# EAGLE schematic 008 (EAGLE 9.6.2)

## Sheet 1 of 3
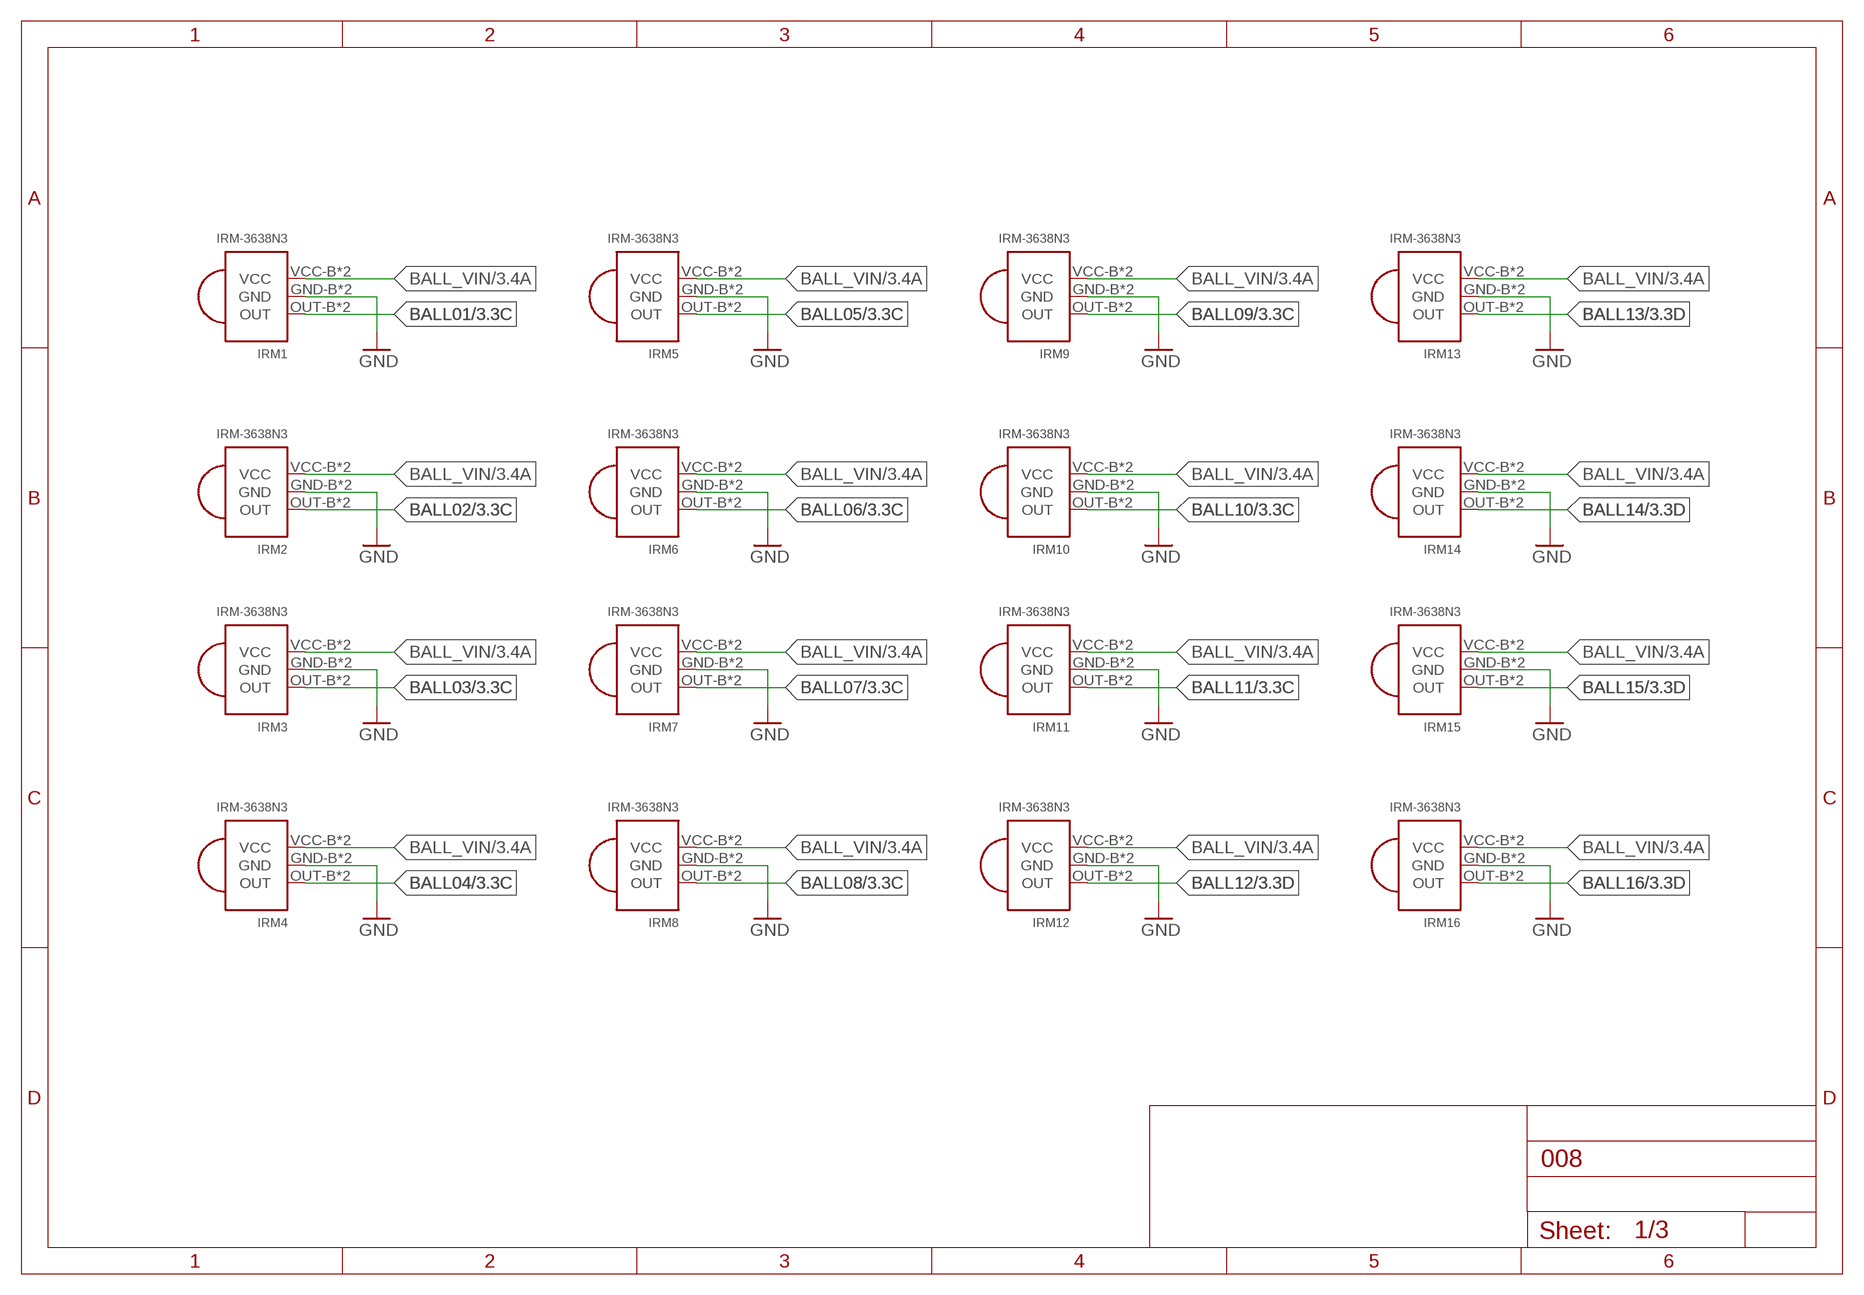
[diagram p0: schematic, sheet 1]

### Parts
IRM1  IRM-3638N3  MYPARTS_IRM_3633N3IRM  [MYPARTS_IRM_3633N3]
IRM2  IRM-3638N3  MYPARTS_IRM_3633N3IRM  [MYPARTS_IRM_3633N3]
IRM3  IRM-3638N3  MYPARTS_IRM_3633N3IRM  [MYPARTS_IRM_3633N3]
IRM4  IRM-3638N3  MYPARTS_IRM_3633N3IRM  [MYPARTS_IRM_3633N3]
IRM5  IRM-3638N3  MYPARTS_IRM_3633N3IRM  [MYPARTS_IRM_3633N3]
IRM6  IRM-3638N3  MYPARTS_IRM_3633N3IRM  [MYPARTS_IRM_3633N3]
IRM7  IRM-3638N3  MYPARTS_IRM_3633N3IRM  [MYPARTS_IRM_3633N3]
IRM8  IRM-3638N3  MYPARTS_IRM_3633N3IRM  [MYPARTS_IRM_3633N3]
IRM9  IRM-3638N3  MYPARTS_IRM_3633N3IRM  [MYPARTS_IRM_3633N3]
IRM10  IRM-3638N3  MYPARTS_IRM_3633N3IRM  [MYPARTS_IRM_3633N3]
IRM11  IRM-3638N3  MYPARTS_IRM_3633N3IRM  [MYPARTS_IRM_3633N3]
IRM12  IRM-3638N3  MYPARTS_IRM_3633N3IRM  [MYPARTS_IRM_3633N3]
IRM13  IRM-3638N3  MYPARTS_IRM_3633N3IRM  [MYPARTS_IRM_3633N3]
IRM14  IRM-3638N3  MYPARTS_IRM_3633N3IRM  [MYPARTS_IRM_3633N3]
IRM15  IRM-3638N3  MYPARTS_IRM_3633N3IRM  [MYPARTS_IRM_3633N3]
IRM16  IRM-3638N3  MYPARTS_IRM_3633N3IRM  [MYPARTS_IRM_3633N3]

### Nets
BALL01: IRM1.OUT-B(OUT) IRM1.OUT-T(OUT) ; also sheet 3
BALL02: IRM2.OUT-B(OUT) IRM2.OUT-T(OUT) ; also sheet 3
BALL03: IRM3.OUT-B(OUT) IRM3.OUT-T(OUT) ; also sheet 3
BALL04: IRM4.OUT-B(OUT) IRM4.OUT-T(OUT) ; also sheet 3
BALL05: IRM5.OUT-B(OUT) IRM5.OUT-T(OUT) ; also sheet 3
BALL06: IRM6.OUT-B(OUT) IRM6.OUT-T(OUT) ; also sheet 3
BALL07: IRM7.OUT-B(OUT) IRM7.OUT-T(OUT) ; also sheet 3
BALL08: IRM8.OUT-B(OUT) IRM8.OUT-T(OUT) ; also sheet 3
BALL09: IRM9.OUT-B(OUT) IRM9.OUT-T(OUT) ; also sheet 3
BALL10: IRM10.OUT-B(OUT) IRM10.OUT-T(OUT) ; also sheet 3
BALL11: IRM11.OUT-B(OUT) IRM11.OUT-T(OUT) ; also sheet 3
BALL12: IRM12.OUT-B(OUT) IRM12.OUT-T(OUT) ; also sheet 3
BALL13: IRM13.OUT-B(OUT) IRM13.OUT-T(OUT) ; also sheet 3
BALL14: IRM14.OUT-B(OUT) IRM14.OUT-T(OUT) ; also sheet 3
BALL15: IRM15.OUT-B(OUT) IRM15.OUT-T(OUT) ; also sheet 3
BALL16: IRM16.OUT-B(OUT) IRM16.OUT-T(OUT) ; also sheet 3
BALL_VIN: IRM1.VCC-B(VCC) IRM1.VCC-T(VCC) IRM2.VCC-B(VCC) IRM2.VCC-T(VCC) IRM3.VCC-B(VCC) IRM3.VCC-T(VCC) IRM4.VCC-B(VCC) IRM4.VCC-T(VCC) IRM5.VCC-B(VCC) IRM5.VCC-T(VCC) IRM6.VCC-B(VCC) IRM6.VCC-T(VCC) IRM7.VCC-B(VCC) IRM7.VCC-T(VCC) IRM8.VCC-B(VCC) IRM8.VCC-T(VCC) IRM9.VCC-B(VCC) IRM9.VCC-T(VCC) IRM10.VCC-B(VCC) IRM10.VCC-T(VCC) IRM11.VCC-B(VCC) IRM11.VCC-T(VCC) IRM12.VCC-B(VCC) IRM12.VCC-T(VCC) IRM13.VCC-B(VCC) IRM13.VCC-T(VCC) IRM14.VCC-B(VCC) IRM14.VCC-T(VCC) IRM15.VCC-B(VCC) IRM15.VCC-T(VCC) IRM16.VCC-B(VCC) IRM16.VCC-T(VCC) ; also sheet 3
GND [PWR]: IRM1.GND-B(GND) IRM1.GND-T(GND) IRM2.GND-B(GND) IRM2.GND-T(GND) IRM3.GND-B(GND) IRM3.GND-T(GND) IRM4.GND-B(GND) IRM4.GND-T(GND) IRM5.GND-B(GND) IRM5.GND-T(GND) IRM6.GND-B(GND) IRM6.GND-T(GND) IRM7.GND-B(GND) IRM7.GND-T(GND) IRM8.GND-B(GND) IRM8.GND-T(GND) IRM9.GND-B(GND) IRM9.GND-T(GND) IRM10.GND-B(GND) IRM10.GND-T(GND) IRM11.GND-B(GND) IRM11.GND-T(GND) IRM12.GND-B(GND) IRM12.GND-T(GND) IRM13.GND-B(GND) IRM13.GND-T(GND) IRM14.GND-B(GND) IRM14.GND-T(GND) IRM15.GND-B(GND) IRM15.GND-T(GND) IRM16.GND-B(GND) IRM16.GND-T(GND) ; also sheet 2,3

## Sheet 2 of 3
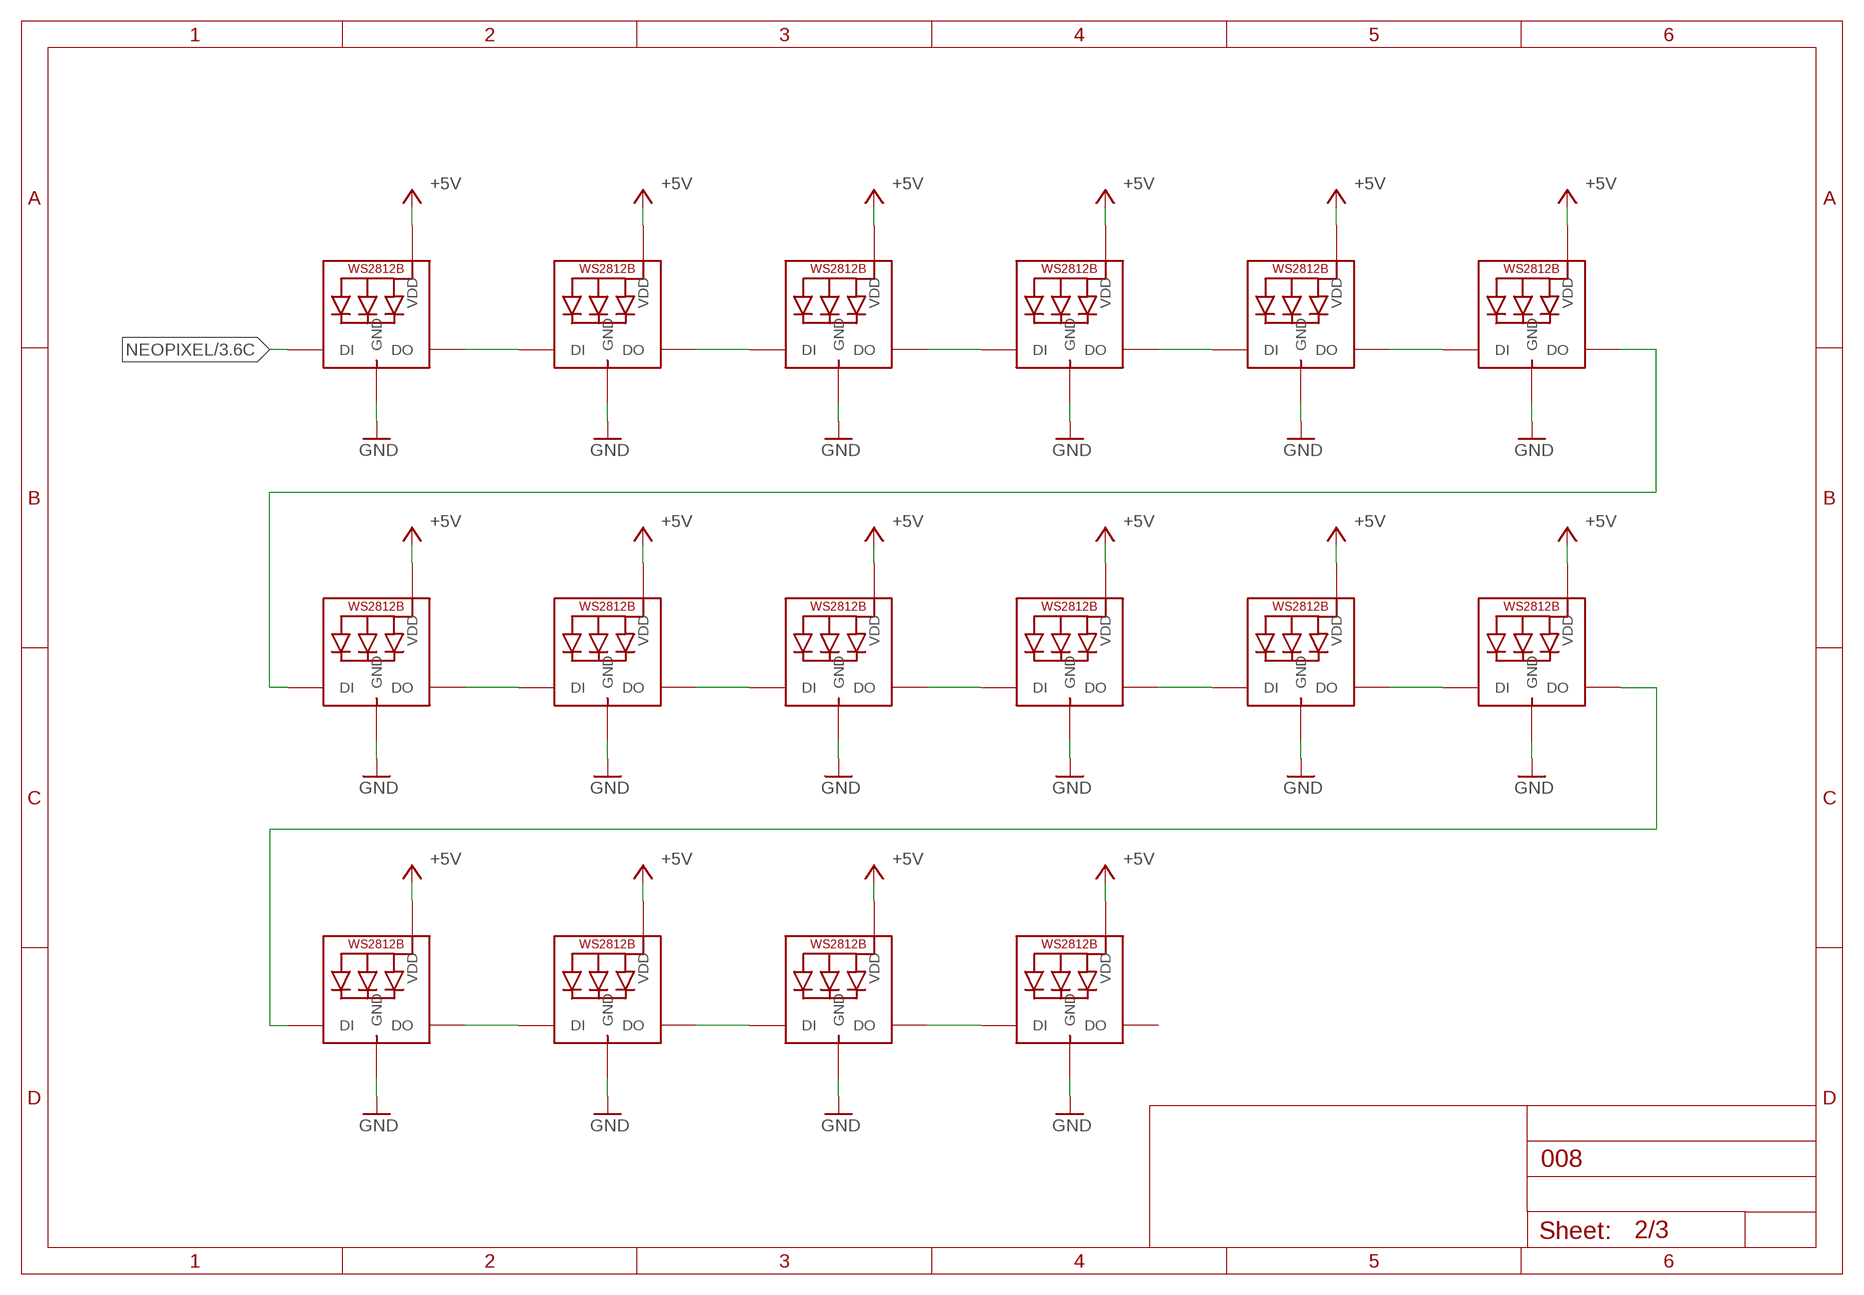
[diagram p1: schematic, sheet 2]

### Parts
LED1  WS2812B5050  [WS2812B]
LED2  WS2812B5050  [WS2812B]
LED3  WS2812B5050  [WS2812B]
LED4  WS2812B5050  [WS2812B]
LED5  WS2812B5050  [WS2812B]
LED6  WS2812B5050  [WS2812B]
LED7  WS2812B5050  [WS2812B]
LED8  WS2812B5050  [WS2812B]
LED9  WS2812B5050  [WS2812B]
LED10  WS2812B5050  [WS2812B]
LED11  WS2812B5050  [WS2812B]
LED12  WS2812B5050  [WS2812B]
LED13  WS2812B5050  [WS2812B]
LED14  WS2812B5050  [WS2812B]
LED15  WS2812B5050  [WS2812B]
LED16  WS2812B5050  [WS2812B]

### Nets
+5V [PWR]: LED1.1-VDD(VDD) LED2.1-VDD(VDD) LED3.1-VDD(VDD) LED4.1-VDD(VDD) LED5.1-VDD(VDD) LED6.1-VDD(VDD) LED7.1-VDD(VDD) LED8.1-VDD(VDD) LED9.1-VDD(VDD) LED10.1-VDD(VDD) LED11.1-VDD(VDD) LED12.1-VDD(VDD) LED13.1-VDD(VDD) LED14.1-VDD(VDD) LED15.1-VDD(VDD) LED16.1-VDD(VDD) ; also sheet 3
GND [PWR]: LED1.3-GND(GND) LED2.3-GND(GND) LED3.3-GND(GND) LED4.3-GND(GND) LED5.3-GND(GND) LED6.3-GND(GND) LED7.3-GND(GND) LED8.3-GND(GND) LED9.3-GND(GND) LED10.3-GND(GND) LED11.3-GND(GND) LED12.3-GND(GND) LED13.3-GND(GND) LED14.3-GND(GND) LED15.3-GND(GND) LED16.3-GND(GND) ; also sheet 1,3
N$1: LED12.2-DOUT(DO) LED13.4-DIN(DI)
N$2: LED6.2-DOUT(DO) LED7.4-DIN(DI)
NEOPIXEL: LED1.4-DIN(DI) ; also sheet 3
NEOPIXEL1: LED1.2-DOUT(DO) LED2.4-DIN(DI)
NEOPIXEL2: LED2.2-DOUT(DO) LED3.4-DIN(DI)
NEOPIXEL3: LED3.2-DOUT(DO) LED4.4-DIN(DI)
NEOPIXEL4: LED4.2-DOUT(DO) LED5.4-DIN(DI)
NEOPIXEL5: LED5.2-DOUT(DO) LED6.4-DIN(DI)
NEOPIXEL6: LED7.2-DOUT(DO) LED8.4-DIN(DI)
NEOPIXEL7: LED8.2-DOUT(DO) LED9.4-DIN(DI)
NEOPIXEL8: LED9.2-DOUT(DO) LED10.4-DIN(DI)
NEOPIXEL9: LED10.2-DOUT(DO) LED11.4-DIN(DI)
NEOPIXEL10: LED11.2-DOUT(DO) LED12.4-DIN(DI)
NEOPIXEL11: LED13.2-DOUT(DO) LED14.4-DIN(DI)
NEOPIXEL12: LED14.2-DOUT(DO) LED15.4-DIN(DI)
NEOPIXEL13: LED15.2-DOUT(DO) LED16.4-DIN(DI)
Unconnected: LED16.2-DOUT(DO)

## Sheet 3 of 3
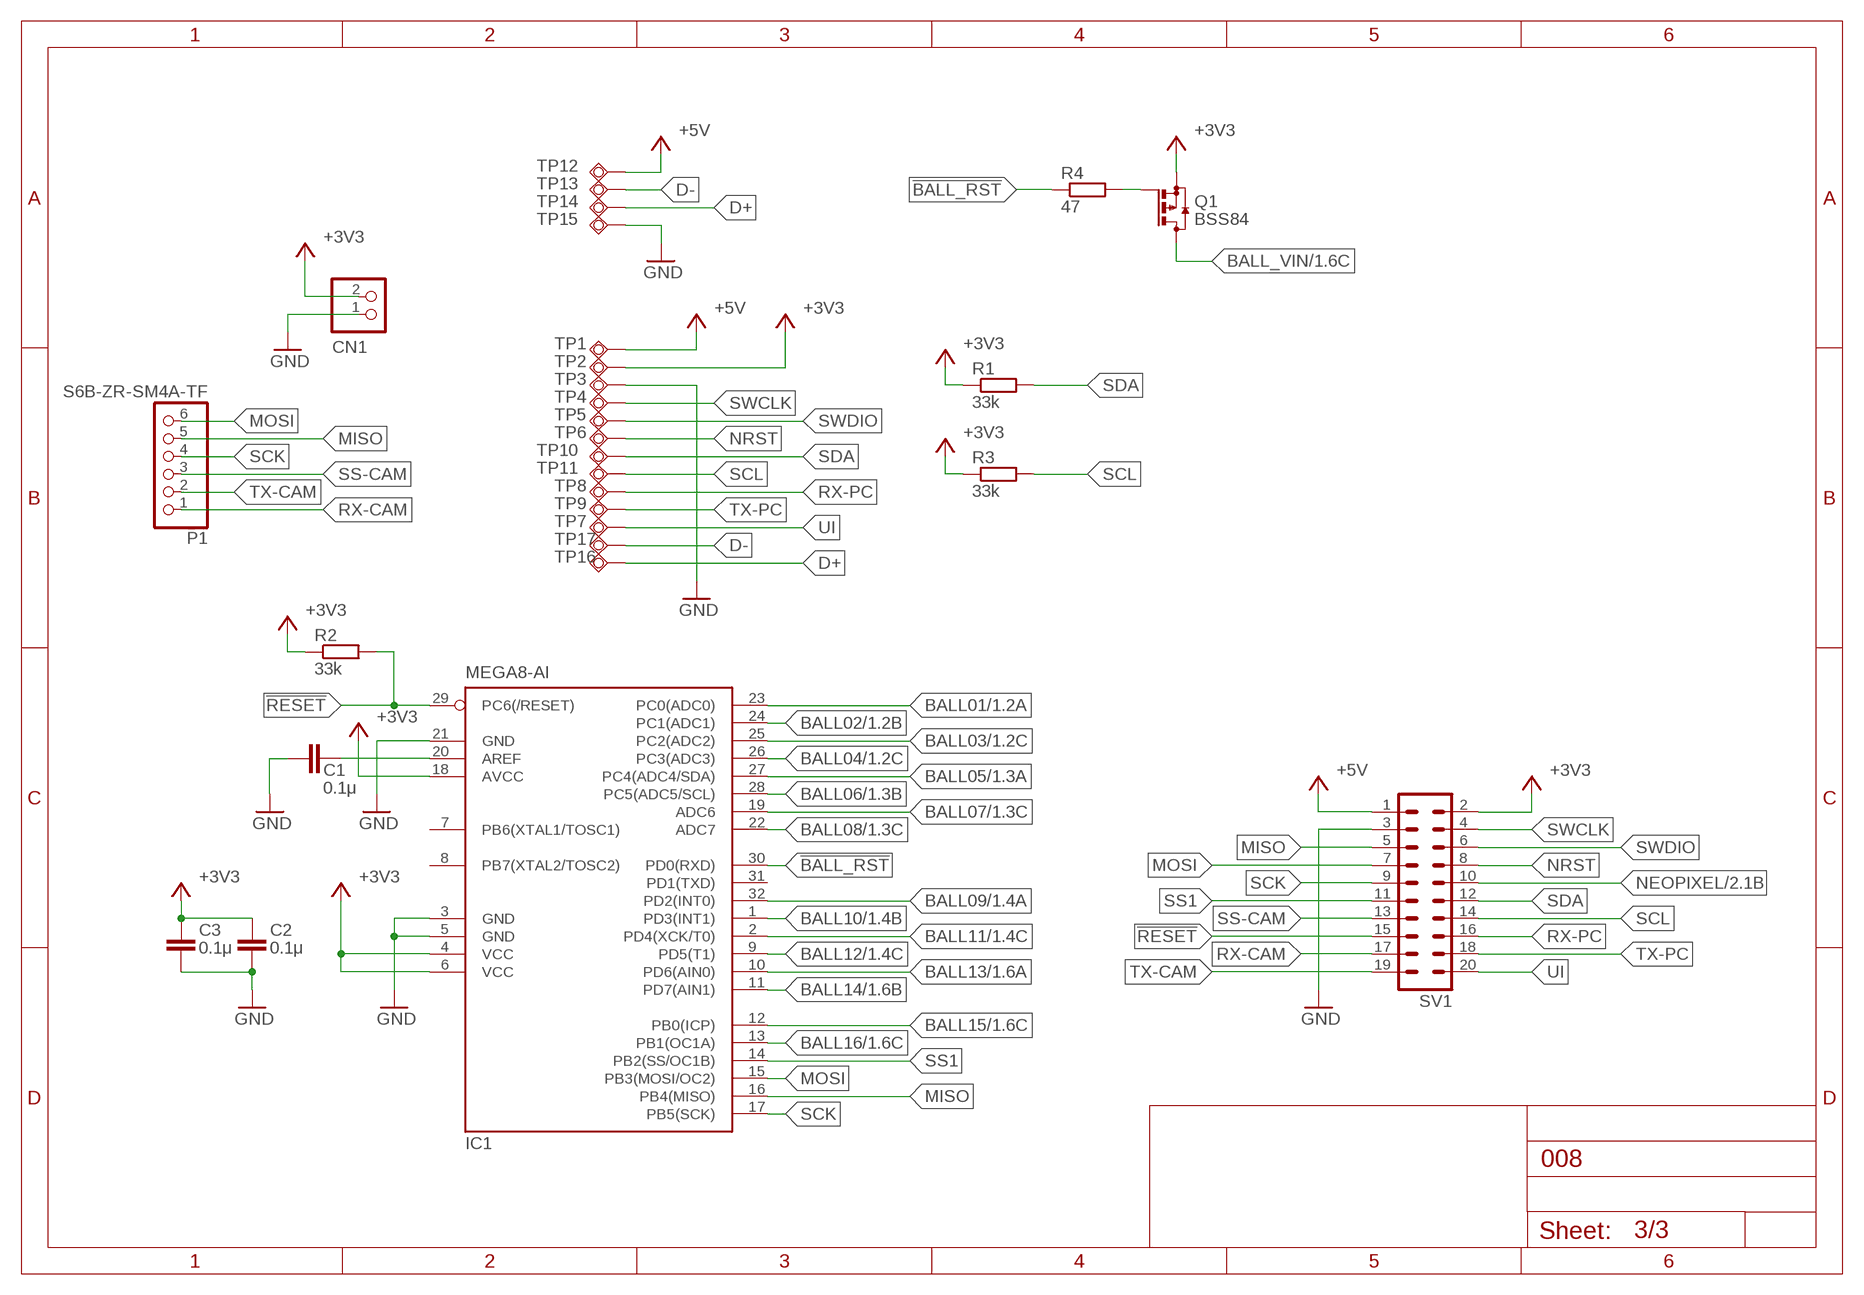
[diagram p2: schematic, sheet 3]

### Parts
C1  0.1μ  C-EUC1608  [C1608]
C2  0.1μ  C-EUC1608  [C1608]
C3  0.1μ  C-EUC1608  [C1608]
CN1  S2B-PH-SM4-TB  [S2B-PH-SM4-TB]
IC1  MEGA8-AI  [TQFP32-08]
P1  S6B-ZR-SM4A-TF  [ZH-SM4-SIDE06]
Q1  BSS84  [SOT23]
R1  33k  R-EU_R0603  [R0603]
R2  33k  R-EU_R0603  [R0603]
R3  33k  R-EU_R0603  [R0603]
R4  47  R-EU_R0603  [R0603]
SV1  ML20  [ML20]
TP1  TPSQTP10SQ  [TP10SQ]
TP2  TPSQTP10R  [TP10R]
TP3  TPSQTP10R  [TP10R]
TP4  TPSQTP10R  [TP10R]
TP5  TPSQTP10R  [TP10R]
TP6  TPSQTP10R  [TP10R]
TP7  TPSQTP10R  [TP10R]
TP8  TPSQTP10R  [TP10R]
TP9  TPSQTP10R  [TP10R]
TP10  TPSQTP10R  [TP10R]
TP11  TPSQTP10R  [TP10R]
TP12  TPSQTP10SQ  [TP10SQ]
TP13  TPSQTP10R  [TP10R]
TP14  TPSQTP10R  [TP10R]
TP15  TPSQTP10R  [TP10R]
TP16  TPSQTP10R  [TP10R]
TP17  TPSQTP10R  [TP10R]

### Nets
!BALL_RST: IC1.30(PD0(RXD)) R4.1
!RESET: IC1.29(PC6(/RESET)) R2.2 SV1.15
+3V3 [PWR]: C2.1 C3.1 CN1.2 IC1.4(VCC) IC1.6(VCC) IC1.18(AVCC) Q1.2(S) R1.1 R2.1 R3.1 SV1.2 TP2.TP
+5V [PWR]: SV1.1 TP1.TP TP12.TP ; also sheet 2
BALL01: IC1.23(PC0(ADC0)) ; also sheet 1
BALL02: IC1.24(PC1(ADC1)) ; also sheet 1
BALL03: IC1.25(PC2(ADC2)) ; also sheet 1
BALL04: IC1.26(PC3(ADC3)) ; also sheet 1
BALL05: IC1.27(PC4(ADC4/SDA)) ; also sheet 1
BALL06: IC1.28(PC5(ADC5/SCL)) ; also sheet 1
BALL07: IC1.19(ADC6) ; also sheet 1
BALL08: IC1.22(ADC7) ; also sheet 1
BALL09: IC1.32(PD2(INT0)) ; also sheet 1
BALL10: IC1.1(PD3(INT1)) ; also sheet 1
BALL11: IC1.2(PD4(XCK/T0)) ; also sheet 1
BALL12: IC1.9(PD5(T1)) ; also sheet 1
BALL13: IC1.10(PD6(AIN0)) ; also sheet 1
BALL14: IC1.11(PD7(AIN1)) ; also sheet 1
BALL15: IC1.12(PB0(ICP)) ; also sheet 1
BALL16: IC1.13(PB1(OC1A)) ; also sheet 1
BALL_VIN: Q1.3(D) ; also sheet 1
D+: TP14.TP TP16.TP
D-: TP13.TP TP17.TP
GND [PWR]: C1.2 C2.2 C3.2 CN1.1 IC1.3(GND) IC1.5(GND) IC1.21(GND) SV1.3 TP3.TP TP15.TP ; also sheet 1,2
MISO: IC1.16(PB4(MISO)) P1.5 SV1.5
MOSI: IC1.15(PB3(MOSI/OC2)) P1.6 SV1.7
N$3: C1.1 IC1.20(AREF)
N$4: Q1.1(G) R4.2
NEOPIXEL: SV1.10 ; also sheet 2
NRST: SV1.8 TP6.TP
RX-CAM: P1.1 SV1.17
RX-PC: SV1.16 TP8.TP
SCK: IC1.17(PB5(SCK)) P1.4 SV1.9
SCL: R3.2 SV1.14 TP11.TP
SDA: R1.2 SV1.12 TP10.TP
SS1: IC1.14(PB2(SS/OC1B)) SV1.11
SS-CAM: P1.3 SV1.13
SWCLK: SV1.4 TP4.TP
SWDIO: SV1.6 TP5.TP
TX-CAM: P1.2 SV1.19
TX-PC: SV1.18 TP9.TP
UI: SV1.20 TP7.TP
Unconnected: IC1.7(PB6(XTAL1/TOSC1)) IC1.8(PB7(XTAL2/TOSC2)) IC1.31(PD1(TXD))

## Library data of the parts
C1-C3 = rcl:C-EU: CAPACITOR, European symbol; SPICEPREFIX: C
CN1 = jst-ph:S2B-PH-*: Wire-to-Board 2.0mm pitch side mount connector Source: http://www.jst-mfg.com/product/pdf/jpn/PH.pdf http://www.jst-mfg.com/product/detail.php?series=199
IC1 = atmel:MEGA8: MICROCONTROLLER 8 Kbytes FLASH, 1 kbytes SRAM, 512 bytes EEPROM, USART, 6-channel 10 bit ADC, 2-channel 8 bit ADC Pin compatible with Atmega48, ATMega88, ATMega168 Source: avr.lbr; MPN: ATMEGA8-16AU; OC_FARNELL: 9171371; OC_NEWARK: 73M8863
IRM1-IRM16 = #002-CPU:MYPARTS_IRM_3633N3
LED1-LED16 = microbuilder:WS2812B
P1 = zh:S6B-ZR-SM4A-TF
Q1 = transistor-small-signal:BSS84: P-CHANNEL MOS FET
R1-R4 = rcl:R-EU_: RESISTOR, European symbol; SPICEPREFIX: R
SV1 = con-ml:ML20: HARTING; OC_FARNELL: unknown; OC_NEWARK: unknown
TP1-TP17 = testpad:TPSQ: Test pad

## Net classes
0 default: width 0.254 mm
1 PWR: width 0.508 mm